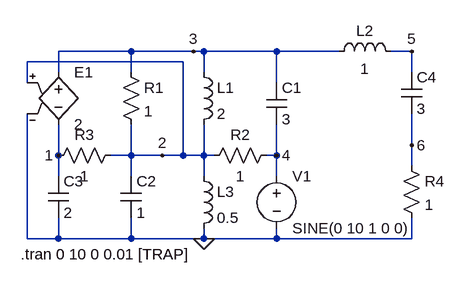
[diagram p0: schematic Circuito-LoucoLTSPICE.asc]
Circuito-LoucoLTSPICE.asc, the LTspice schematic file:
Version 4
SHEET 1 880 680
WIRE 224 64 112 64
WIRE 320 64 224 64
WIRE 336 64 320 64
WIRE 448 64 336 64
WIRE 544 64 448 64
WIRE 656 64 624 64
WIRE 304 80 64 80
WIRE 112 96 112 64
WIRE 224 96 224 64
WIRE 336 96 336 64
WIRE 656 96 656 64
WIRE 64 112 64 80
WIRE 448 112 448 64
WIRE 656 208 656 160
WIRE 112 224 112 176
WIRE 224 224 224 176
WIRE 224 224 192 224
WIRE 272 224 224 224
WIRE 304 224 304 80
WIRE 304 224 272 224
WIRE 336 224 336 176
WIRE 336 224 304 224
WIRE 352 224 336 224
WIRE 448 224 448 176
WIRE 448 224 432 224
WIRE 656 240 656 208
WIRE 112 256 112 224
WIRE 224 256 224 224
WIRE 336 256 336 224
WIRE 448 256 448 224
WIRE 64 352 64 160
WIRE 112 352 112 320
WIRE 112 352 64 352
WIRE 224 352 224 320
WIRE 224 352 112 352
WIRE 336 352 336 336
WIRE 336 352 224 352
WIRE 448 352 448 336
WIRE 448 352 336 352
WIRE 656 352 656 320
WIRE 656 352 448 352
FLAG 336 352 0
FLAG 112 224 1
FLAG 272 224 2
FLAG 320 64 3
FLAG 448 224 4
FLAG 656 64 5
FLAG 656 208 6
SYMBOL res 208 80 R0
SYMATTR InstName R1
SYMATTR Value 1
SYMBOL ind 320 80 R0
SYMATTR InstName L1
SYMATTR Value 2
SYMBOL cap 432 112 R0
SYMATTR InstName C1
SYMATTR Value 3
SYMBOL ind 528 80 R270
WINDOW 0 32 56 VTop 2
WINDOW 3 5 56 VBottom 2
SYMATTR InstName L2
SYMATTR Value 1
SYMBOL res 448 208 R90
WINDOW 0 0 56 VBottom 2
WINDOW 3 32 56 VTop 2
SYMATTR InstName R2
SYMATTR Value 1
SYMBOL ind 320 240 R0
SYMATTR InstName L3
SYMATTR Value 0.5
SYMBOL cap 208 256 R0
SYMATTR InstName C2
SYMATTR Value 1
SYMBOL res 208 208 R90
WINDOW 0 0 56 VBottom 2
WINDOW 3 32 56 VTop 2
SYMATTR InstName R3
SYMATTR Value 1
SYMBOL voltage 448 240 R0
WINDOW 123 0 0 Left 2
WINDOW 39 0 0 Left 2
SYMATTR InstName V1
SYMATTR Value SINE(0 10 1 0 0)
SYMBOL cap 96 256 R0
SYMATTR InstName C3
SYMATTR Value 2
SYMBOL cap 640 96 R0
SYMATTR InstName C4
SYMATTR Value 3
SYMBOL res 640 224 R0
SYMATTR InstName R4
SYMATTR Value 1
SYMBOL e 112 80 R0
SYMATTR InstName E1
SYMATTR Value 2
TEXT 54 376 Left 2 !.tran 0 10 0 0.01 [TRAP]

The netlist it stands for:
* Circuito-LoucoLTSPICE.asc
R1 3 2 1
L1 3 2 2
C1 3 4 3
L2 3 5 1
R2 4 2 1
L3 2 0 0.5
C2 2 0 1
R3 2 1 1
V1 4 0 SINE(0 10 1 0 0)
C3 1 0 2
C4 5 6 3
R4 6 0 1
E1 3 1 2 0 2
.tran 0 10 0 0.01 [TRAP]
.backanno
.end